# EAGLE schematic midiprog3b (EAGLE 4.16)
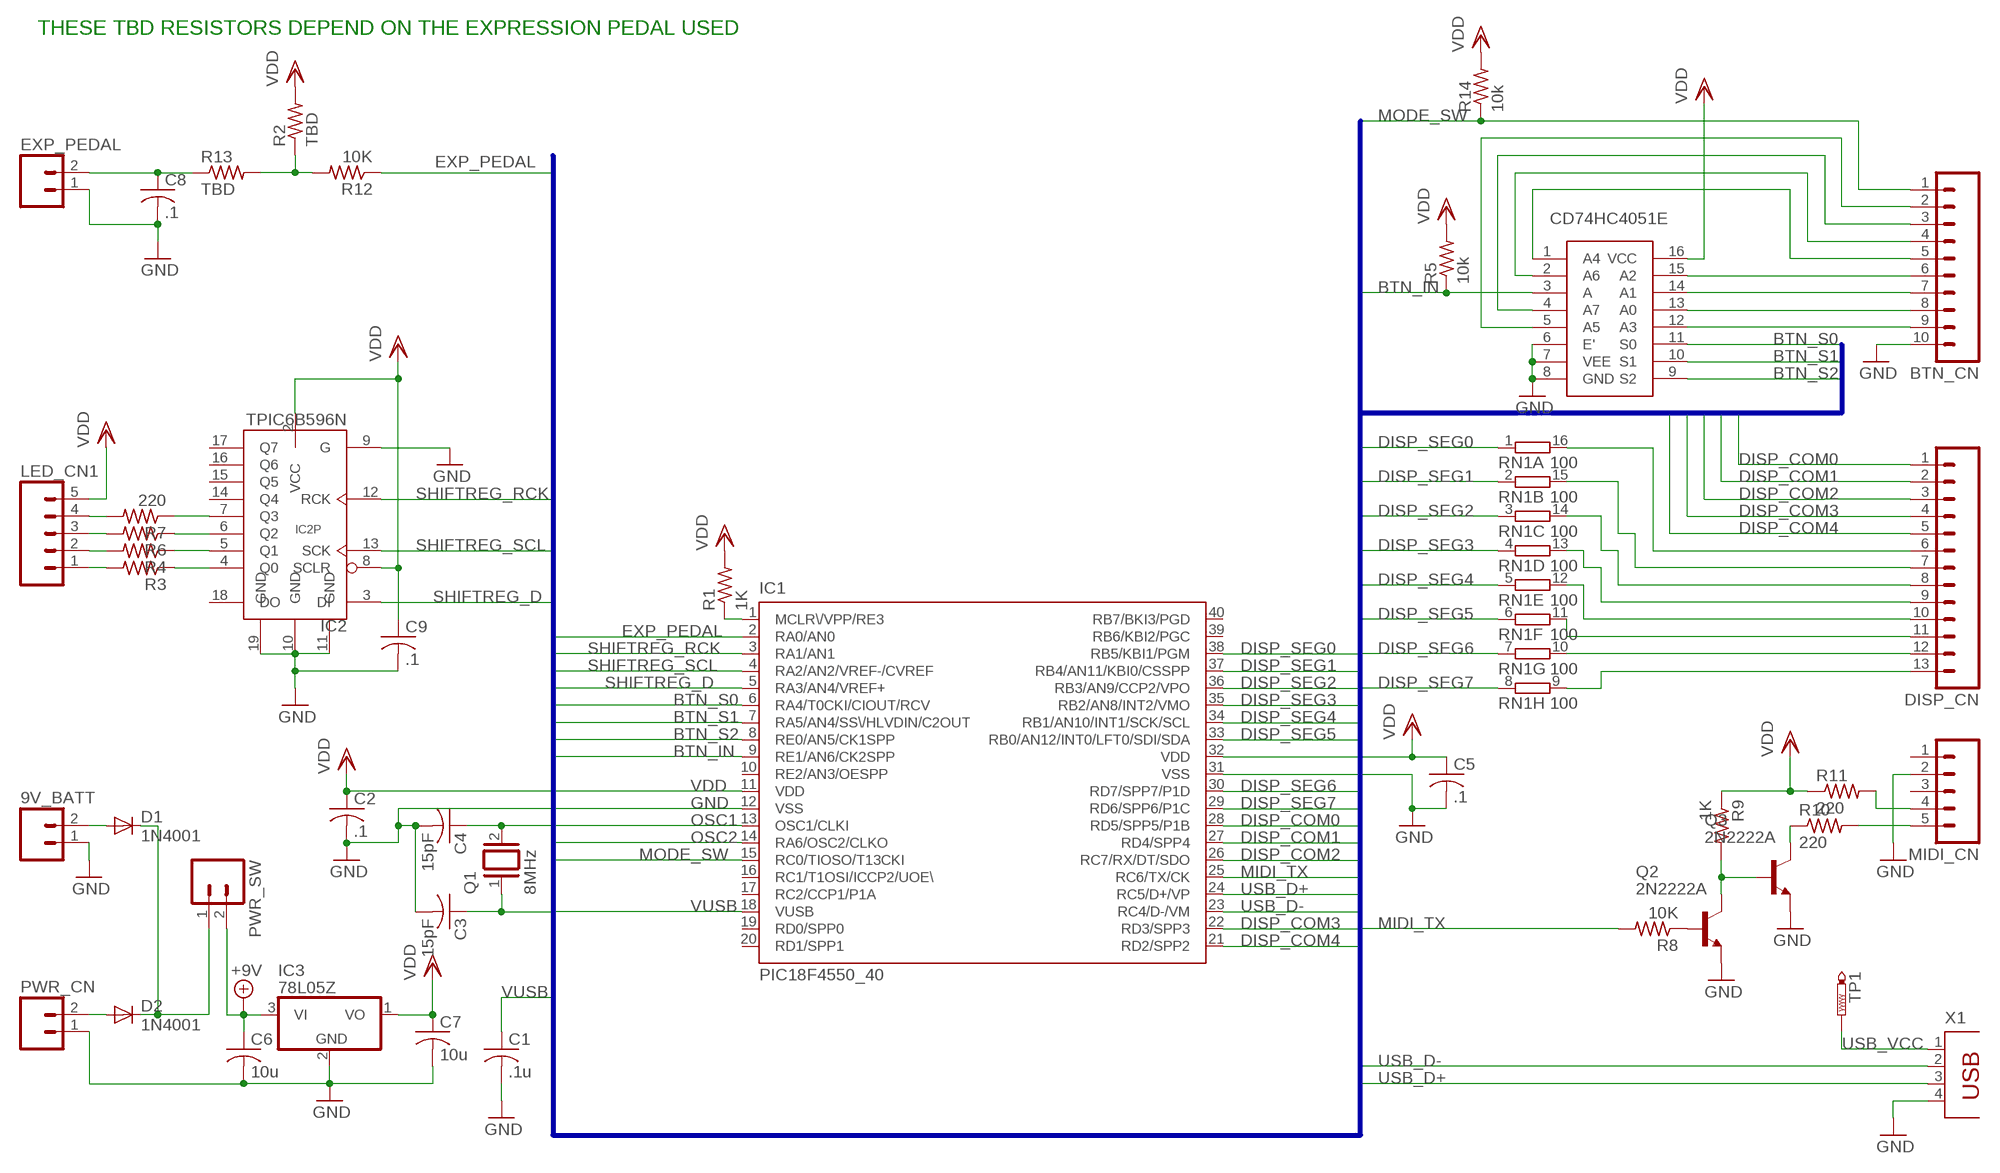
[diagram p0: schematic, sheet 1]

## Parts
9V_BATT  M02  [02P]
BTN_CN  M10  [10P]
C1  .1u  C-US050-025X075  [C050-025X075]
C2  .1  C-US050-025X075  [C050-025X075]
C3  15pF  C-US050-025X075  [C050-025X075]
C4  15pF  C-US050-025X075  [C050-025X075]
C5  .1  C-US050-025X075  [C050-025X075]
C6  10u  C-US050-025X075  [C050-025X075]
C7  10u  C-US050-025X075  [C050-025X075]
C8  .1  C-US050-025X075  [C050-025X075]
C9  .1  C-US050-025X075  [C050-025X075]
D1  1N4001  1N4004  [DO41-10]
D2  1N4001  1N4004  [DO41-10]
DISP_CN  M13  [13P]
EXP_PEDAL  M02  [02P]
IC1  PIC18F4550_40  [DIL40]
IC2  TPIC6B596N  [DIL20]
IC3  78L05Z  [TO92]
LED_CN1  M05  [05P]
MIDI_CN  MA05  [05PA]
PWR_CN  M02  [02P]
PWR_SW  M02  [02P]
Q1  8MHz  XTAL  [Q]
Q2  2N2222A  [TO18]
Q3  2N2222A  [TO18]
R1  1K  R-US_0207/10  [0207/10]
R2  TBD  R-US_0207/10  [0207/10]
R3  R-US_0207/10  [0207/10]
R4  R-US_0207/10  [0207/10]
R5  10k  R-US_0207/10  [0207/10]
R6  R-US_0207/10  [0207/10]
R7  220  R-US_0207/10  [0207/10]
R8  10K  R-US_0207/10  [0207/10]
R9  1K  R-US_0207/10  [0207/10]
R10  220  R-US_0207/10  [0207/10]
R11  220  R-US_0207/10  [0207/10]
R12  10K  R-US_0207/10  [0207/10]
R13  TBD  R-US_0207/10  [0207/10]
R14  10k  R-US_0207/10  [0207/10]
RN1  100  8R-N  [DIL16]
TP1  PTR1PAD1-17  [P1-17]
U$1  CD74HC4051E  [CD74HC4051E]
X1  PN61729  [PN61729]

## Nets
+9V: C6.1 IC3.3(VI) PWR_SW.2
BTN_IN: IC1.9(RE1/AN6/CK2SPP) R5.1 U$1.3(A)
BTN_S0: IC1.6(RA4/T0CKI/CIOUT/RCV) U$1.11(S0)
BTN_S1: IC1.7(RA5/AN4/SS\/HLVDIN/C2OUT) U$1.10(S1)
BTN_S2: IC1.8(RE0/AN5/CK1SPP) U$1.9(S2)
DISP_COM0: DISP_CN.1 IC1.28(RD5/SPP5/P1B)
DISP_COM1: DISP_CN.2 IC1.27(RD4/SPP4)
DISP_COM2: DISP_CN.3 IC1.26(RC7/RX/DT/SDO)
DISP_COM3: DISP_CN.4 IC1.22(RD3/SPP3)
DISP_COM4: DISP_CN.5 IC1.21(RD2/SPP2)
DISP_SEG0: IC1.38(RB5/KBI1/PGM) RN1.1
DISP_SEG1: IC1.37(RB4/AN11/KBI0/CSSPP) RN1.2
DISP_SEG2: IC1.36(RB3/AN9/CCP2/VPO) RN1.3
DISP_SEG3: IC1.35(RB2/AN8/INT2/VMO) RN1.4
DISP_SEG4: IC1.34(RB1/AN10/INT1/SCK/SCL) RN1.5
DISP_SEG5: IC1.33(RB0/AN12/INT0/LFT0/SDI/SDA) RN1.6
DISP_SEG6: IC1.30(RD7/SPP7/P1D) RN1.7
DISP_SEG7: IC1.29(RD6/SPP6/P1C) RN1.8
EXP_PEDAL: IC1.2(RA0/AN0) R12.1
GND: 9V_BATT.1 BTN_CN.10 C1.2 C2.2 C3.2 C4.2 C5.2 C6.2 C7.2 C8.2 C9.2 EXP_PEDAL.1 IC1.12(VSS) IC1.31(VSS) IC2.9(G) IC2.10(GND) IC2.11(GND) IC2.19(GND) IC3.2(GND) MIDI_CN.2 PWR_CN.1 Q2.1(E) Q3.1(E) U$1.6(E') U$1.7(VEE) U$1.8(GND) X1.4
MIDI_TX: IC1.25(RC6/TX/CK) R8.2
MODE_SW: BTN_CN.1 IC1.15(RC0/TIOSO/T13CKI) R14.1
N$1: IC1.1(MCLR\/VPP/RE3) R1.1
N$2: BTN_CN.3 U$1.4(A7)
N$3: IC2.4(Q0) R3.1
N$4: Q2.2(B) R8.1
N$5: Q2.3(C) Q3.2(B) R9.2
N$6: LED_CN1.1 R3.2
N$7: Q3.3(C) R10.1
N$8: MIDI_CN.5 R10.2
N$9: MIDI_CN.4 R11.2
N$10: BTN_CN.6 U$1.15(A2)
N$11: BTN_CN.7 U$1.14(A1)
N$12: BTN_CN.8 U$1.13(A0)
N$13: BTN_CN.9 U$1.12(A3)
N$14: BTN_CN.4 U$1.2(A6)
N$15: BTN_CN.5 U$1.1(A4)
N$16: DISP_CN.13 RN1.9
N$17: DISP_CN.12 RN1.10
N$18: DISP_CN.11 RN1.11
N$19: DISP_CN.10 RN1.12
N$20: DISP_CN.9 RN1.13
N$21: DISP_CN.8 RN1.14
N$22: DISP_CN.7 RN1.15
N$23: DISP_CN.6 RN1.16
N$24: LED_CN1.2 R4.2
N$25: IC2.5(Q1) R4.1
N$26: IC2.6(Q2) R6.1
N$27: LED_CN1.3 R6.2
N$28: LED_CN1.4 R7.2
N$29: IC2.7(Q3) R7.1
N$30: BTN_CN.2 U$1.5(A5)
N$31: C8.1 EXP_PEDAL.2 R13.1
N$32: R2.1 R12.2 R13.2
N$33: 9V_BATT.2 D1.A
N$34: D2.A PWR_CN.2
N$35: D1.C D2.C PWR_SW.1
OSC1: C4.1 IC1.13(OSC1/CLKI) Q1.2
OSC2: C3.1 IC1.14(RA6/OSC2/CLKO) Q1.1
SHIFTREG_D: IC1.5(RA3/AN4/VREF+) IC2.3(DI)
SHIFTREG_RCK: IC1.3(RA1/AN1) IC2.12(RCK)
SHIFTREG_SCL: IC1.4(RA2/AN2/VREF-/CVREF) IC2.13(SCK)
USB_D+: IC1.24(RC5/D+/VP) X1.3
USB_D-: IC1.23(RC4/D-/VM) X1.2
USB_VCC: TP1.1(TP) X1.1
VDD: C2.1 C5.1 C7.1 C9.1 IC1.11(VDD) IC1.32(VDD) IC2.2(VCC) IC2.8(SCLR) IC3.1(VO) LED_CN1.5 R1.2 R2.2 R5.2 R9.1 R11.1 R14.2 U$1.16(VCC)
VUSB: C1.1 IC1.18(VUSB)
Unconnected: IC1.10(RE2/AN3/OESPP) IC1.16(RC1/T1OSI/ICCP2/UOE\) IC1.17(RC2/CCP1/P1A) IC1.19(RD0/SPP0) IC1.20(RD1/SPP1) IC1.39(RB6/KBI2/PGC) IC1.40(RB7/BKI3/PGD) IC2.14(Q4) IC2.15(Q5) IC2.16(Q6) IC2.17(Q7) IC2.18(DO) MIDI_CN.1 MIDI_CN.3

## Buses
BUS1

## Notes on the sheet
- THESE TBD RESISTORS DEPEND ON THE EXPRESSION PEDAL USED

## Library data of the parts
9V_BATT EXP_PEDAL PWR_CN PWR_SW = con-amp-quick:M02: AMP QUICK CONNECTOR
BTN_CN = con-amp-quick:M10: AMP QUICK CONNECTOR
C1-C9 = rcl:C-US: CAPACITOR, American symbol
D1 D2 = diode:1N4004: DIODE general purpose rectifier, 1 A
DISP_CN = con-amp-quick:M13: AMP QUICK CONNECTOR
IC1 = microchip:PIC18F4*_40: USB Microcontrollers with nanoWatt Technology High-Performance, Enhanced Flash, 28/40/44-Pin, Source: http://ww1.microchip.com/downloads/en/devicedoc/39632c.pdf
IC2 = tpic:TPIC6B596
IC3 = linear:78*: Positive VOLTAGE REGULATOR Source: http://cache.national.com/ds/LM/LM78L05.pdf http://www.fairchildsemi.com/ds/LM/LM7805.pdf
LED_CN1 = con-amp-quick:M05: AMP QUICK CONNECTOR
MIDI_CN = con-amp-quick:MA05: AMP QUICK CONNECTOR
Q1 = special:XTAL: CRYSTAL
Q2 Q3 = transistor-npn:2N2222*: NPN Transistor
R1-R14 = rcl:R-US_: RESISTOR, American symbol
RN1 = resistor-dil:8R-N: DIL RESISTOR
TP1 = testpad:PTR1: TEST PIN
U$1 = joe:CD74HC4051E
X1 = con-berg:PN61729: BERG USB connector